# Altium schematic sheet Sheet1.SchDoc
size A
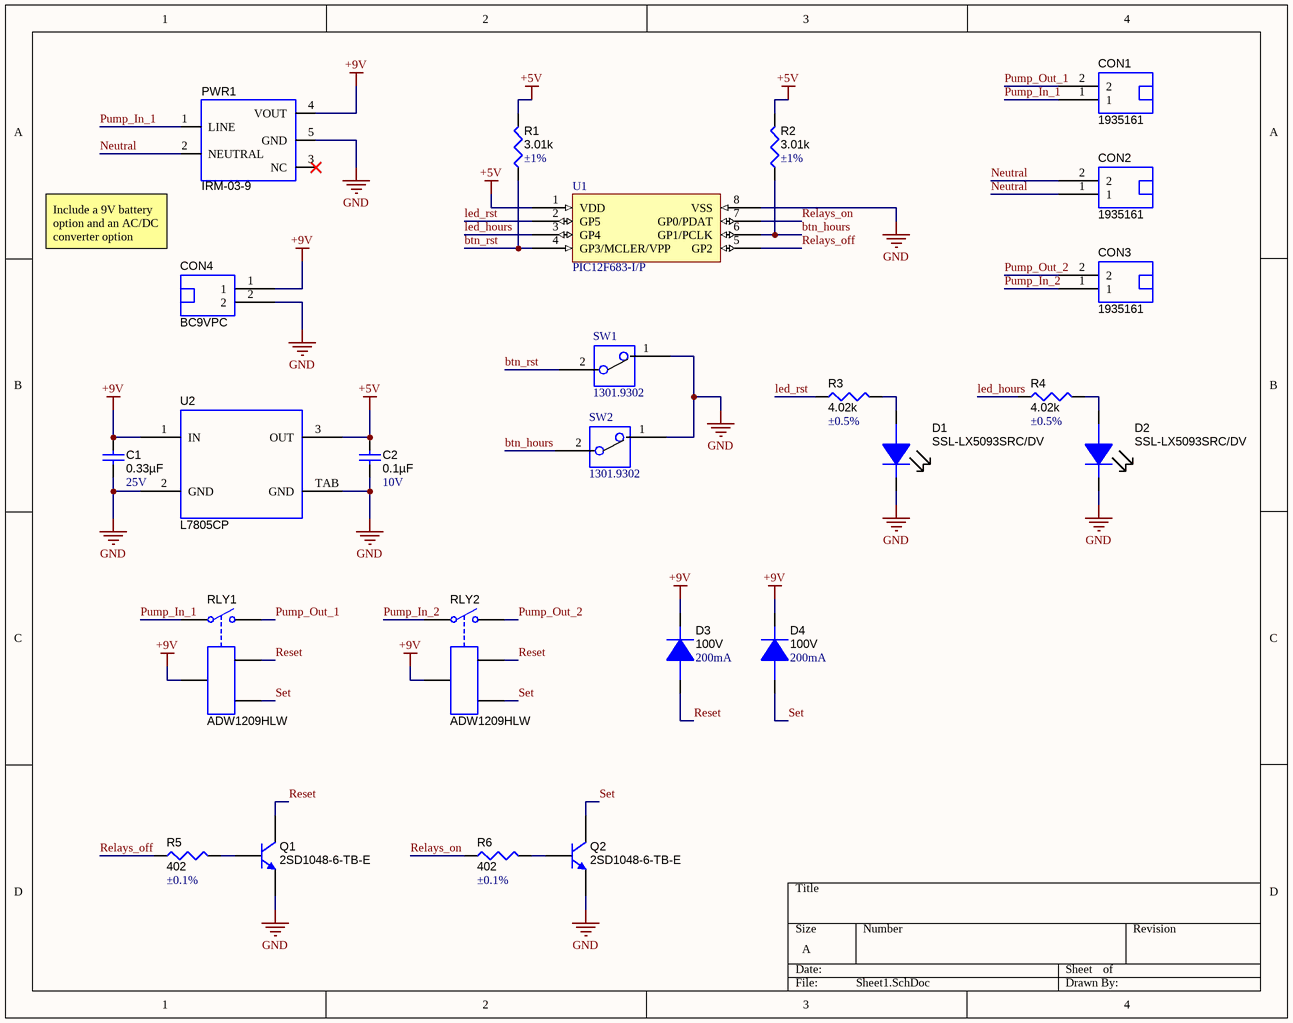
[diagram p0: Sheet1.SchDoc]

## Parts
C1  0.33µF  Parameters: 25V  [0805]
C2  0.1µF  Parameters: 10V  [0402_C]
CON1  1935161  [5MM-CON-2]
CON2  1935161  [5MM-CON-2]
CON3  1935161  [5MM-CON-2]
CON4  BC9VPC  [9V BATTERY HOLDER]
D1  SSL-LX5093SRC/DV  [RB-.1/.250]
D2  SSL-LX5093SRC/DV  [RB-.1/.250]
D3  100V  Parameters: 200mA  [SOD123]
D4  100V  Parameters: 200mA  [SOD123]
PWR1  IRM-03-9  [IRM-03-9]
Q1  2SD1048-6-TB-E  [SOT-23]
Q2  2SD1048-6-TB-E  [SOT-23]
R1  3.01k  Parameters: ±1%  [0603_R]
R2  3.01k  Parameters: ±1%  [0603_R]
R3  4.02k  Parameters: ±0.5%  [0805_R]
R4  4.02k  Parameters: ±0.5%  [0805_R]
R5  402  Parameters: ±0.1%  [0805_R]
R6  402  Parameters: ±0.1%  [0805_R]
RLY1  ADW1209HLW  [ADW1 LOW-PROFILE RELAY]
RLY2  ADW1209HLW  [ADW1 LOW-PROFILE RELAY]
SW1  1301.9302  [4 PIN SPST PUSH BUTTON]
SW2  1301.9302  [4 PIN SPST PUSH BUTTON]
U1  PIC12F683-I/P  [DIP8]
U2  L7805CP  [L7805]

## Nets
+5V: C2.2 R1.2 R2.2 U1.1(VDD) U2.3(OUT)
+9V: C1.2 CON4.1 D3.2(K) D4.2(K) PWR1.4(VOUT) RLY1.2 RLY2.2 U2.1(IN)
GND: C1.1 C2.1 CON4.2 D1.2(K) D2.2(K) PWR1.5(GND) Q1.E Q2.E SW1.1 SW2.1 U1.8(VSS) U2.2(GND) U2.TAB(GND)
btn_hours: R2.1 SW2.2 U1.6(GP1/PCLK)
btn_rst: R1.1 SW1.2 U1.4(GP3/MCLER/VPP)
led_hours: R4.1 U1.3(GP4)
led_rst: R3.1 U1.2(GP5)
Neutral: CON2.1 CON2.2 PWR1.2(NEUTRAL)
Pump_In_1: CON1.1 PWR1.1(LINE) RLY1.5
Pump_In_2: CON3.1 RLY2.5
Pump_Out_1: CON1.2 RLY1.4
Pump_Out_2: CON3.2 RLY2.4
Relays_off: R5.1 U1.5(GP2)
Relays_on: R6.1 U1.7(GP0/PDAT)
Reset: D3.1(A) Q1.C RLY1.3 RLY2.3
Set: D4.1(A) Q2.C RLY1.1 RLY2.1
NetD1_1: D1.1(A) R3.2
NetD2_1: D2.1(A) R4.2
NetQ1_B: Q1.B R5.2
NetQ2_B: Q2.B R6.2

Not connected (* = marked no-connect by the designer): PWR1 3(NC)*

## Notes on the sheet
- (near PWR1) Include a 9V battery option and an AC/DC converter option

## Library data of the parts
C1 = 4447: CAP CER 0.33UF 25V 10% X7R 0805; Manufacturer Part Number: 08053C334KAZ2A; Manufacturer: AVX Corporation; Part Category: Capacitors; Part Verified: False; Internal PN: 4447; Cost 1pc: 0.36; Cost 100pc: 0.1568; Cost 1000pc: 0.10304; Primary Vendor Stock: 7252; Current Inventory: 0; SLInvtID: PDI-04447; Value: 0.33µF; Supplier Part Number 1: 478-3556-1-ND; Supplier 1: Digi-Key; RoHS Compliant: True; ComponentLink1Description: Datasheet Document
C2 = 5433: CAP CER 0.1UF 10V 10% X7R 0402; Manufacturer Part Number: C1005X7R1A104K; Manufacturer: TDK Corporation; Part Category: Capacitors; Part Verified: False; Internal PN: 5433; Cost 1pc: 0.1; Cost 100pc: 0.0121; Cost 1000pc: 0.0066; Primary Vendor Stock: 617771; Current Inventory: 0; SLInvtID: PDI-05433; Value: 0.1µF; Supplier Part Number 1: 445-4958-1-ND; Supplier 1: Digi-Key; RoHS Compliant: True; Simulation: CAP; ComponentLink1Description: Datasheet Document; Signal Integrity: Cap
CON1-CON3 = 9497: 2 POSITION SCREW TERMINAL WIRE TO BOARD TERMINAL BLOCK HORIZONTAL WITH BOARD 0.197" (5.00MM) THROUGH HOLE; Manufacturer: Phoenix Contact; Part Category: Connectors; Part Verified: False; Internal PN: 9497; Cost 1pc: 0.43; Cost 100pc: 0.38; Cost 1000pc: 0.3; Primary Vendor Stock: 0; Current Inventory: 15956; SLInvtID: PDI-09497; Manufacturer Part Number: 1935161; Supplier Part Number 1: 277-1667-ND; Supplier 1: Digi-Key; RoHS Compliant: False; Value: 1935161; ComponentLink1Description: Datasheet Document
CON4 = 9498: BATTERY HOLDER (OPEN) 9V 1 CELL PC PIN; Manufacturer: MPD; Part Category: Connectors; Part Verified: False; Internal PN: 9498; Cost 1pc: 1.98; Cost 100pc: 1.38; Cost 1000pc: 1.11; Primary Vendor Stock: 0; Current Inventory: 13655; SLInvtID: PDI-09498; Manufacturer Part Number: BC9VPC; Supplier Part Number 1: BC9VPC-ND; Supplier 1: Digi-Key; RoHS Compliant: False; Value: BC9VPC; ComponentLink1Description: Datasheet Document
D1 D2 = 1335: LED 5MM 1500MCD SUPER RED WTRCLR; Manufacturer: Lumex Opto/Components Inc; Part Category: Optoelectronics; Part Verified: False; Internal PN: 1335; Cost 1pc: 0.39; Cost 100pc: 0.184; Cost 1000pc: 0.092; Primary Vendor Stock: 27040; Current Inventory: 0; SLInvtID: PDI-01335; Manufacturer Part Number: SSL-LX5093SRC/DV; Supplier Part Number 1: 67-1610-ND; Supplier 1: Digi-Key; RoHS Compliant: True; Value: SSL-LX5093SRC/DV; ComponentLink1Description: Datasheet Document
D3 D4 = 9142: DIODE GEN PURP 100V 200MA SOD123; Manufacturer Part Number: MMSD914T1G; Manufacturer: ON Semiconductor; Part Category: Diodes; Part Verified: False; Internal PN: 9142; Cost 1pc: 0.2; Cost 100pc: 0.0998; Cost 1000pc: 0.04186; Primary Vendor Stock: 0; SLInvtID: PDI-09142; Supplier Part Number 1: MMSD914T1GOSCT-ND; Supplier 1: Digi-Key; RoHS Compliant: True; Value: 100V; ComponentLink1Description: Datasheet Document; Current Inventory: 0
PWR1 = 9501: ENCLOSED AC DC CONVERTERS 1 UITGANG 9V    333MA 85 ~ 305 VAC, 120 ~ 430 VDC INPUT; Manufacturer: Mean Well; Part Category: Power Supplies; Part Verified: False; Internal PN: 9501; Cost 1pc: 6.62; Cost 100pc: 5.88; Primary Vendor Stock: 0; Current Inventory: 1855; SLInvtID: PDI-09501; Manufacturer Part Number: IRM-03-9; Supplier Part Number 1: 1866-3022-ND; Supplier 1: Digi-Key; RoHS Compliant: False; Cost 1000pc: 5.88; Value: IRM-03-9; ComponentLink1Description: Datasheet Document
Q1 Q2 = 9500: BIPOLAR (BJT) TRANSISTOR NPN 15V 700MA 250MHZ 200MW SURFACE MOUNT 3-CP; Manufacturer: ON Semiconductor; Part Category: Discrete Semiconductor Products; Part Verified: False; Internal PN: 9500; Cost 1pc: 0.37; Cost 100pc: 0.13; Cost 1000pc: 0.09; Primary Vendor Stock: 0; Current Inventory: 8401; SLInvtID: PDI-09500; Manufacturer Part Number: 2SD1048-6-TB-E; Supplier Part Number 1: 2SD1048-6-TB-EOSCT-ND; Supplier 1: Digi-Key; RoHS Compliant: False; Value: 2SD1048-6-TB-E; ComponentLink1Description: Datasheet Document
R1 R2 = 46: RES SMD 3.01K OHM 1% 1/10W 0402; Manufacturer Part Number: ERJ-2RKF3011X; Manufacturer: Panasonic Electronic Components; Part Category: Resistors; Part Verified: False; Internal PN: 46; Cost 1pc: 0.1; Cost 100pc: 0.011; Cost 1000pc: 0.00496; Primary Vendor Stock: 256361; Current Inventory: 0; SLInvtID: PDI-00046; Value: 3.01k; Supplier Part Number 1: P3.01KLCT-ND; Supplier 1: Digi-Key; RoHS Compliant: True; Simulation: RESISTOR; ComponentLink1Description: Datasheet Document; Signal Integrity: Res
R3 R4 = 188: RES 4.02K OHM 1/10W .5% 0805 SMD; Manufacturer Part Number: RR1220P-4021-D-M; Manufacturer: Susumu; Part Category: Resistors; Part Verified: False; Internal PN: 188; Cost 1pc: 0.1; Cost 100pc: 0.0358; Cost 1000pc: 0.01575; Primary Vendor Stock: 42908; Current Inventory: 140; SLInvtID: PDI-00188; Value: 4.02k; Supplier Part Number 1: RR12P4.02KDCT-ND; Supplier 1: Digi-Key; RoHS Compliant: True; Simulation: RESISTOR; ComponentLink1Description: Datasheet Document; Signal Integrity: Res
R5 R6 = 365: RES 402 OHM 1/10W .1% 0805 SMD; Manufacturer Part Number: RR1220P-4020-B-M-T5; Manufacturer: Susumu; Part Category: Resistors; Part Verified: False; Internal PN: 365; Cost 1pc: 0; SLInvtID: PDI-00365; Value: 402; Supplier Part Number 1: (obsolete) RR12P402BCT-ND; Supplier 1: Digi-Key; RoHS Compliant: True; Cost 100pc: 0; Cost 1000pc: 0; Primary Vendor Stock: 0; Simulation: RESISTOR; ComponentLink1Description: Datasheet Document; Current Inventory: 0; Signal Integrity: Res
RLY1 RLY2 = 9495: GENERAL PURPOSE TWO-COIL RELAY SPST-NO (1 FORM A) 9VDC COIL THROUGH HOLE; Manufacturer: Panasonic - ECG; Part Category: Relays; Part Verified: False; Internal PN: 9495; Cost 1pc: 5.83; Cost 100pc: 4.37; Cost 1000pc: 3.4; Primary Vendor Stock: 0; Current Inventory: 131; SLInvtID: PDI-09495; Manufacturer Part Number: ADW1209HLW; Supplier Part Number 1: 255-5339-ND; Supplier 1: Digi-Key; RoHS Compliant: False; Value: ADW1209HLW; ComponentLink1Description: Datasheet Document
SW1 SW2 = 9499: TACTILE SWITCH SPST-NO TOP ACTUATED THROUGH HOLE; Manufacturer: Schurter Inc.; Part Category: Switches; Part Verified: False; Internal PN: 9499; Cost 1pc: 0.23; Cost 100pc: 0.19; Primary Vendor Stock: 0; Current Inventory: 1762; SLInvtID: PDI-09499; Manufacturer Part Number: 1301.9302; Supplier Part Number 1: 486-3458-ND; Supplier 1: Digi-Key; RoHS Compliant: False; Cost 1000pc: 0.19; Value: 1301.9302; ComponentLink1Description: Datasheet Document
U1 = 94: IC MCU 8BIT 3.5KB FLASH 8DIP; Manufacturer: Microchip Technology; Part Category: Integrated Circuits (ICs); Part Verified: False; Internal PN: 94; Cost 1pc: 1.42; Cost 100pc: 1.12; Primary Vendor Stock: 6555; Current Inventory: 0; SLInvtID: PDI-00094; Manufacturer Part Number: PIC12F683-I/P; Supplier Part Number 1: PIC12F683-I/P-ND; Supplier 1: Digi-Key; RoHS Compliant: True; Cost 1000pc: 1.12; Value: PIC12F683-I/P; ComponentLink1Description: Datasheet Document
U2 = 2376: IC REG LDO 5V 1.5A TO220FP; Manufacturer: STMicroelectronics; Part Category: Integrated Circuits (ICs); Part Verified: False; Internal PN: 2376; Cost 1pc: 0.83; Cost 100pc: 0.5589; Cost 1000pc: 0.3312; Primary Vendor Stock: 3408; Current Inventory: 0; SLInvtID: PDI-02376; Manufacturer Part Number: L7805CP; Supplier Part Number 1: 497-1442-5-ND; Supplier 1: Digi-Key; RoHS Compliant: True; Value: L7805CP; ComponentLink1Description: Datasheet Document